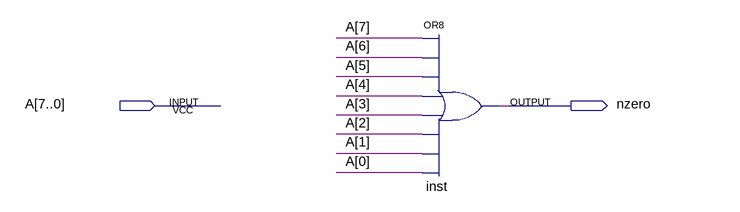
[diagram p0: schematic sheet]
// Quartus schematic nzero.bdf as structural Verilog: 1 symbols, 2 pins
module nzero (
  input  [7:0] A,
  output nzero
);

  or inst (nzero, A[7], A[6], A[5], A[4], A[3], A[2], A[1], A[0]);
endmodule
